# Altium schematic sheet temp_sensor.SchDoc
size A4
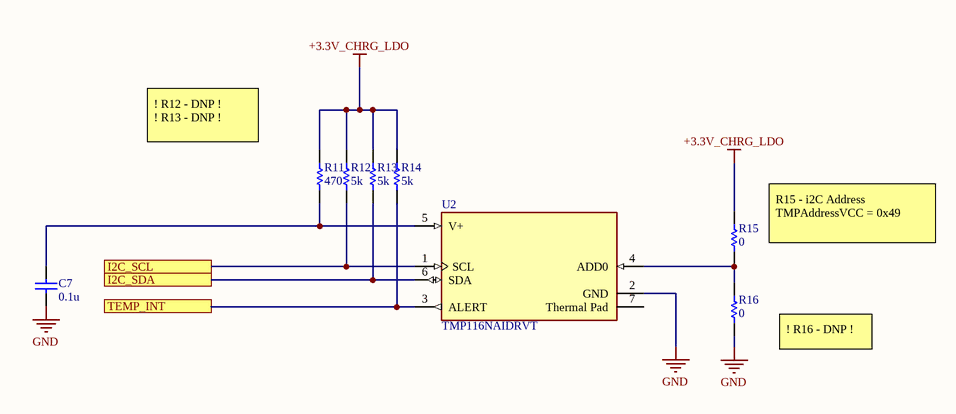
[diagram p0: temp_sensor.SchDoc]

## Parts
C7  0.1u  [CAPC2013X145X50LL20T25]
R11  470  [RESC2013X70X40LL20T20]
R12  5k  [RESC2013X70X40LL20T20]
R13  5k  [RESC2013X70X40LL20T20]
R14  5k  [RESC2013X70X40LL20T20]
R15  0  [RESC2013X70X40LL20T20]
R16  0  [RESC2013X70X40LL20T20]
U2  TMP116NAIDRVT  [FP-DRV0006A-MFG]

## Ports
I2C_SCL, I2C_SDA, TEMP_INT

## Nets
+3.3V_CHRG_LDO: R11.2 R12.2 R13.2 R14.2 R15.2
GND: C7.1 R16.1 U2.2(GND)
I2C_SCL: R12.1 U2.1(SCL) ; port I2C_SCL
I2C_SDA: R13.1 U2.6(SDA) ; port I2C_SDA
TEMP_INT: R14.1 U2.3(ALERT) ; port TEMP_INT
NetC7_2: C7.2 R11.1 U2.5(V+)
NetR15_1: R15.1 R16.2 U2.4(ADD0)

Not connected (* = marked no-connect by the designer): U2 7(Thermal_Pad)

## Notes on the sheet
- ! R12 - DNP !
  ! R13 - DNP !
- (near R15) R15 - i2C Address TMPAddressVCC = 0x49
- (near R16) ! R16 - DNP !

## Library data of the parts
C7 = CMP-2007-01258-1: C0805C104Z5VACTU; Manufacturer: Kemet; Part Number: C0805C104Z5VACTU
R11 = CMP-2001-00419-1: ERJ-6GEYJ471V; Manufacturer: Panasonic; Part Number: ERJ-6GEYJ471V
R12-R16 = CMP-2001-00419-1: 2012; Part Number: ERJ-6GEYJ471V; Manufacturer: Panasonic
U2 = CMP-04948-000020-1: SENSOR DIGITAL -55C-125C 6WSON; Manufacturer: Texas Instruments; Max Supply Voltage: 5.5V; Min Supply Voltage: 1.9V; Standoff Height: 0mm; Accuracy: 0.2%; Operating Supply Current: 3.5-135uA; Max Junction Temp: +150°C; Interface: I2C,SMBus; Resolution: 16bits; Temperature Range High: +125°C; Device Class L1: Sensors; Package: DRV0006A; Temperature Range Low: -55°C; Lead Free: Yes; Digikey Description: SENSOR DIGITAL -55C-125C 6WSON; RoHS: TRUE; Height: 0.8mm; Ambient Temperature Range High: +150°C; Temperature: -55°C to +125°C; ComponentLink2Description: Datasheet; Device Class L3: unset; Ambient Temperature Range Low: -55°C; Category: IC; Octopart: https://octopart.com/tmp116naidrvt-texas+instruments-82367759; Device Class L2: Temperature and Humidity Sensors; Manufacturer Part Number: TMP116NAIDRVT; ComponentLink2URL: http://www.ti.com/lit/ds/symlink/tmp116.pdf; Automotive: No